# Altium project labRat_ArtixSeven.PrjPcb
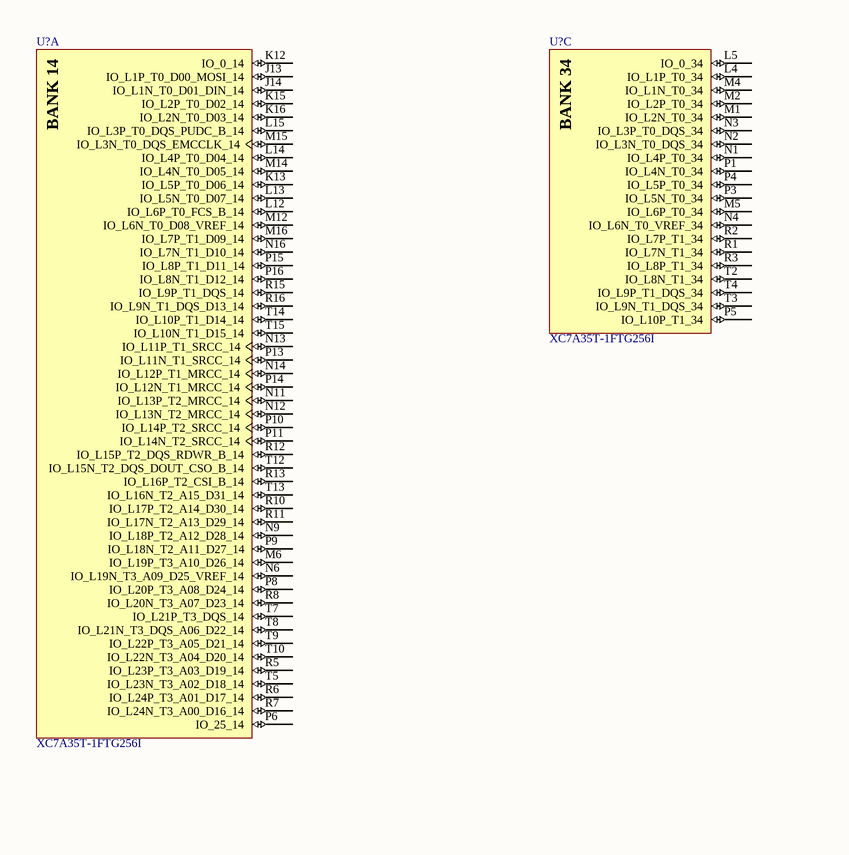
[diagram p0: Main.SchDoc, left]
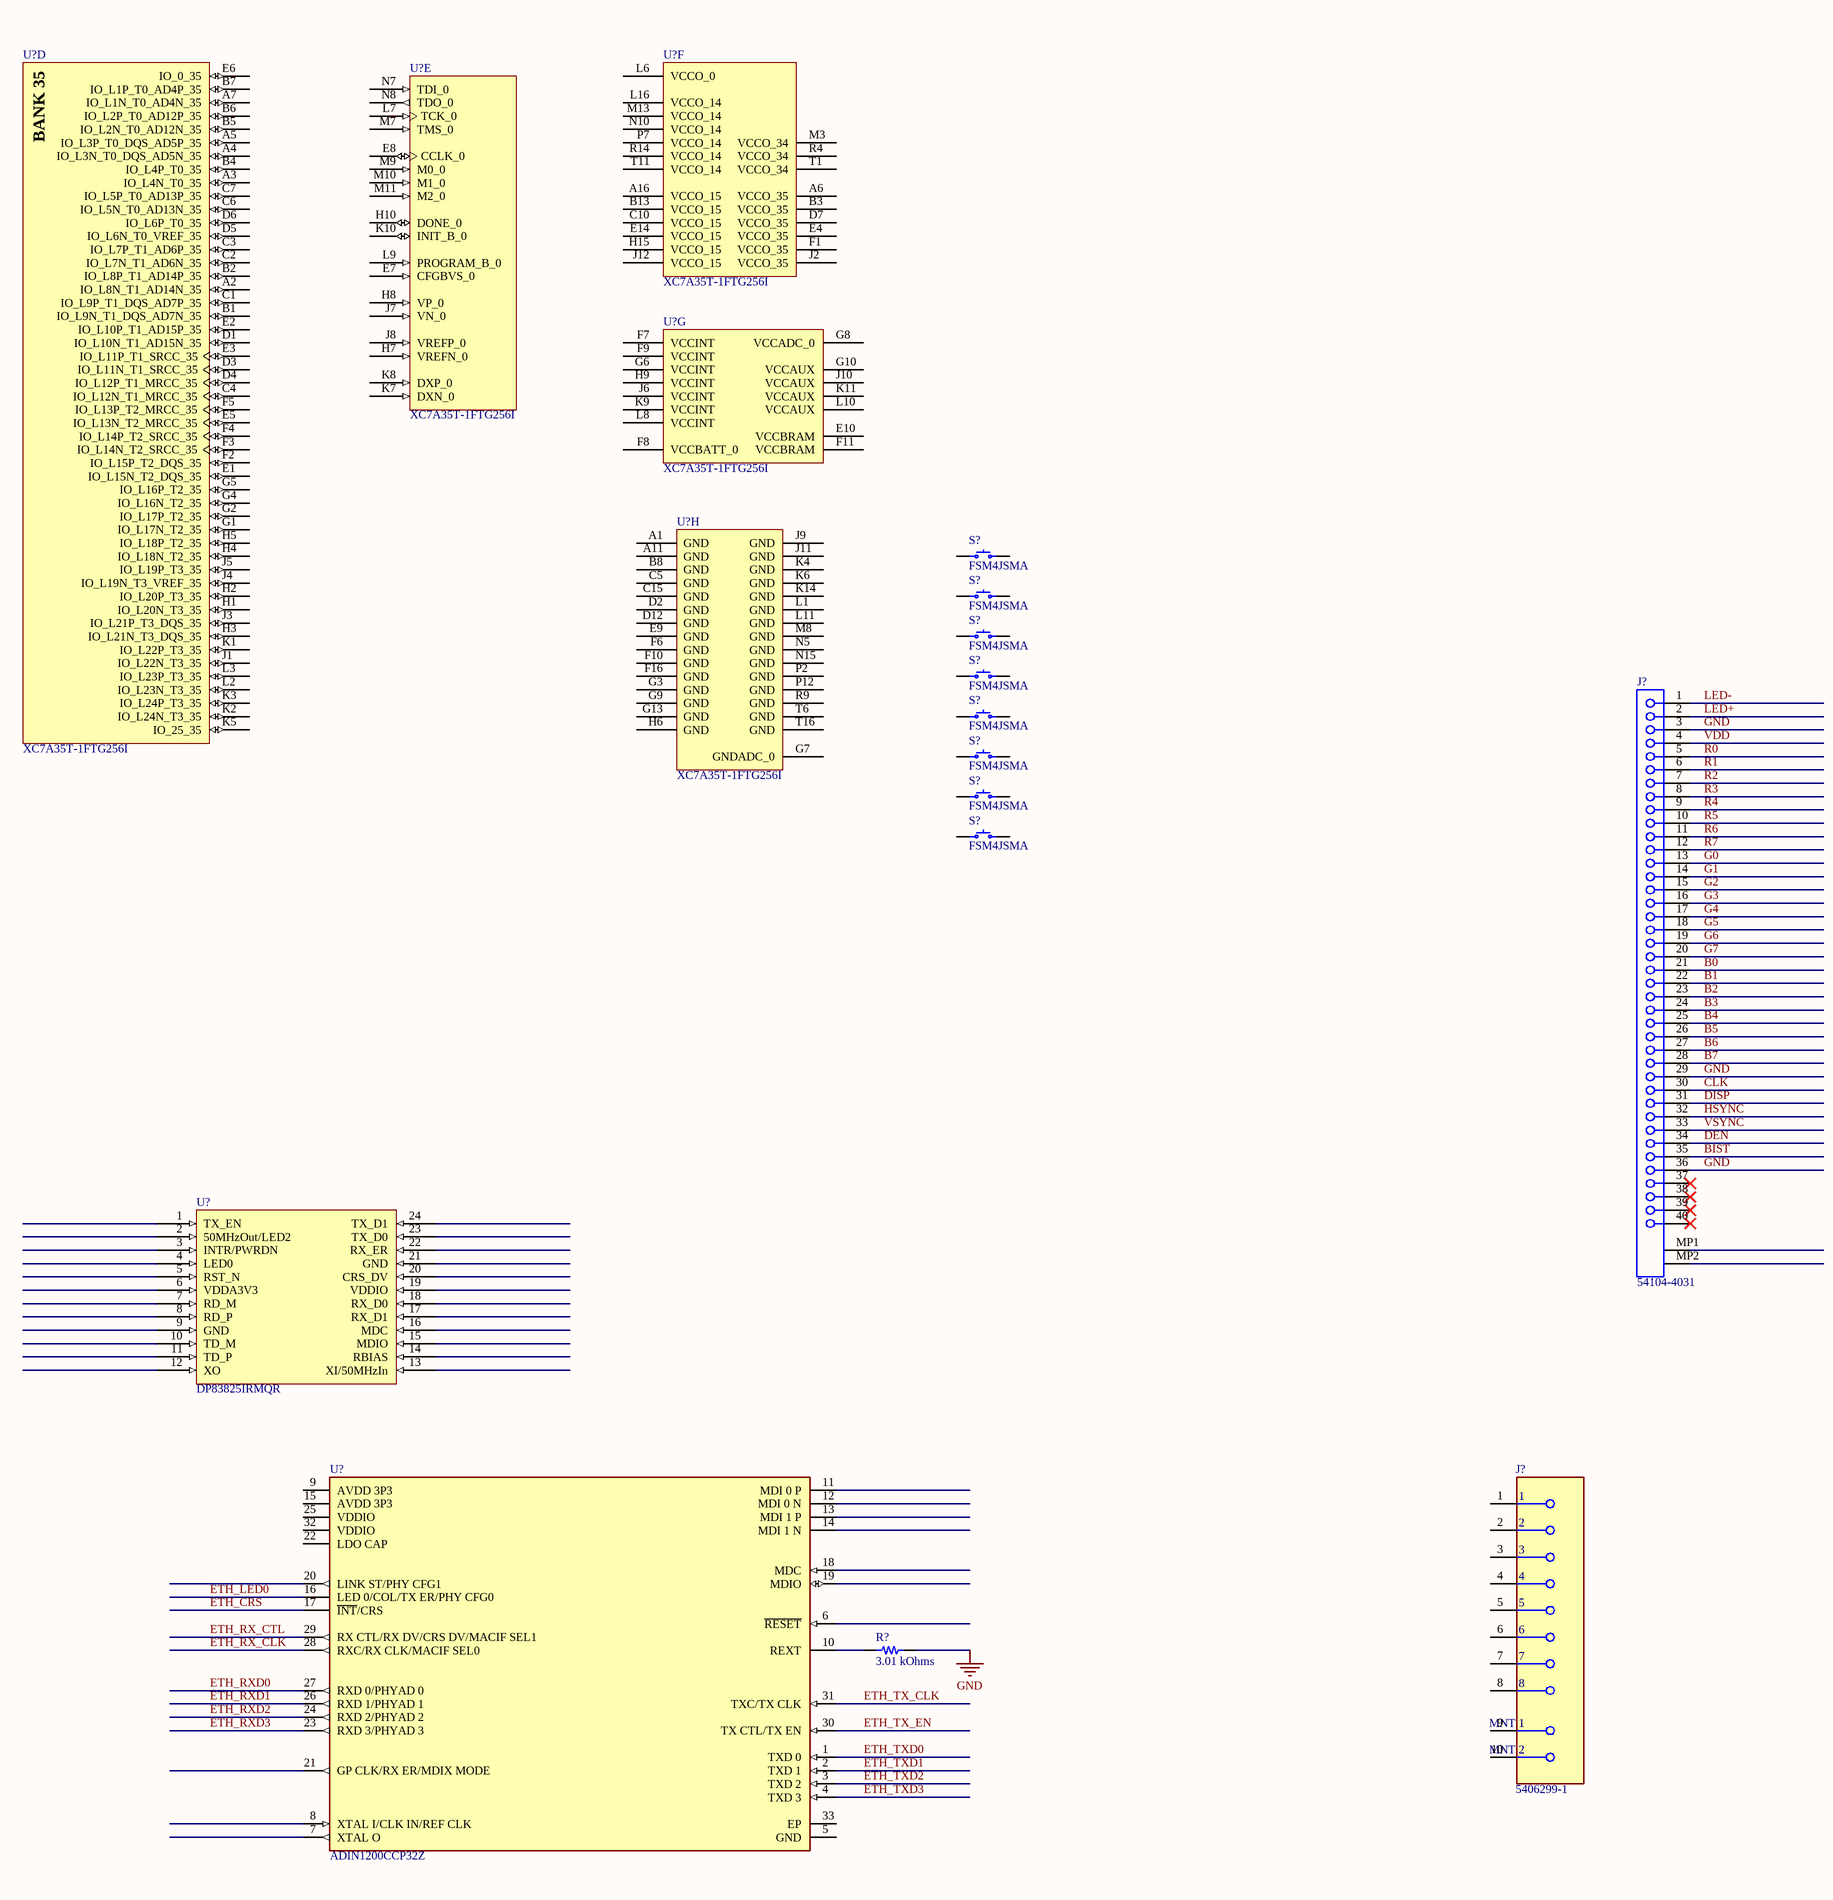
[diagram p1: Main.SchDoc, right]
3 sheets, 63 parts. Net scope: global (net labels, ports and power ports of the same name join across sheets).
Sheets:
  Main.SchDoc
  USB.SchDoc
  DDR3.SchDoc

## Sheet Main.SchDoc
size A2; SheetNumber: 1; SheetTotal: 3

### Parts
(Parts that share a designator on the sheet are numbered #1, #2 ... from top to bottom, then left to right.)
J?#1  54104-4031  [MOLX-54104-4031]
J?#2  5406299-1  [FP-5406299-1-MFG]
R?#1  3.01 kOhms  [RES 0603_1608]
S?#1  FSM4JSMA  [TE FSM4JSMA]
S?#2  FSM4JSMA  [TE FSM4JSMA]
S?#3  FSM4JSMA  [TE FSM4JSMA]
S?#4  FSM4JSMA  [TE FSM4JSMA]
S?#5  FSM4JSMA  [TE FSM4JSMA]
S?#6  FSM4JSMA  [TE FSM4JSMA]
S?#7  FSM4JSMA  [TE FSM4JSMA]
S?#8  FSM4JSMA  [TE FSM4JSMA]
U?#1  XC7A35T-1FTG256I  [FTG256]  (part A of 8)
U?#2  XC7A35T-1FTG256I  [FTG256]  (part C of 8)
U?#3  XC7A35T-1FTG256I  [FTG256]  (part D of 8)
U?#4  XC7A35T-1FTG256I  [FTG256]  (part F of 8)
U?#5  XC7A35T-1FTG256I  [FTG256]  (part E of 8)
U?#6  XC7A35T-1FTG256I  [FTG256]  (part G of 8)
U?#7  XC7A35T-1FTG256I  [FTG256]  (part H of 8)
U?#8  DP83825IRMQR
U?#9  ADIN1200CCP32Z  [FP-CP-32-31-MFG]

### Nets
GND: J?#1.3 J?#1.29 J?#1.36 R?#1.2
B0: J?#1.21
B1: J?#1.22
B2: J?#1.23
B3: J?#1.24
B4: J?#1.25
B5: J?#1.26
B6: J?#1.27
B7: J?#1.28
BIST: J?#1.35
CLK: J?#1.30
DEN: J?#1.34
DISP: J?#1.31
ETH_CRS: U?#9.17(~{INT}/CRS)
ETH_LED0: U?#9.16(LED_0/COL/TX_ER/PHY_CFG0)
ETH_RX_CLK: U?#9.28(RXC/RX_CLK/MACIF_SEL0)
ETH_RX_CTL: U?#9.29(RX_CTL/RX_DV/CRS_DV/MACIF_SEL1)
ETH_RXD0: U?#9.27(RXD_0/PHYAD_0)
ETH_RXD1: U?#9.26(RXD_1/PHYAD_1)
ETH_RXD2: U?#9.24(RXD_2/PHYAD_2)
ETH_RXD3: U?#9.23(RXD_3/PHYAD_3)
ETH_TX_CLK: U?#9.31(TXC/TX_CLK)
ETH_TX_EN: U?#9.30(TX_CTL/TX_EN)
ETH_TXD0: U?#9.1(TXD_0)
ETH_TXD1: U?#9.2(TXD_1)
ETH_TXD2: U?#9.3(TXD_2)
ETH_TXD3: U?#9.4(TXD_3)
G0: J?#1.13
G1: J?#1.14
G2: J?#1.15
G3: J?#1.16
G4: J?#1.17
G5: J?#1.18
G6: J?#1.19
G7: J?#1.20
HSYNC: J?#1.32
LED+: J?#1.2
LED-: J?#1.1
R0: J?#1.5
R1: J?#1.6
R2: J?#1.7
R3: J?#1.8
R4: J?#1.9
R5: J?#1.10
R6: J?#1.11
R7: J?#1.12
VDD: J?#1.4
VSYNC: J?#1.33
NetR?#1_1: R?#1.1 U?#9.10(REXT)
NetS?#1_1: S?#1.1 S?#1.2
NetS?#1_3: S?#1.3 S?#1.4
NetS?#2_1: S?#2.1 S?#2.2
NetS?#2_3: S?#2.3 S?#2.4
NetS?#3_1: S?#3.1 S?#3.2
NetS?#3_3: S?#3.3 S?#3.4
NetS?#4_1: S?#4.1 S?#4.2
NetS?#4_3: S?#4.3 S?#4.4
NetS?#5_1: S?#5.1 S?#5.2
NetS?#5_3: S?#5.3 S?#5.4
NetS?#6_1: S?#6.1 S?#6.2
NetS?#6_3: S?#6.3 S?#6.4
NetS?#7_1: S?#7.1 S?#7.2
NetS?#7_3: S?#7.3 S?#7.4
NetS?#8_1: S?#8.1 S?#8.2
NetS?#8_3: S?#8.3 S?#8.4

Not connected (* = marked no-connect by the designer): J?#1 37* 38* 39* 40* MP1 MP2; J?#2 1 2 3 4 5 6 7 8 9(MNT_1) 10(MNT_2); U?#1 J13(IO_L1P_T0_D00_MOSI_14) J14(IO_L1N_T0_D01_DIN_14) K12(IO_0_14) K13(IO_L5P_T0_D06_14) K15(IO_L2P_T0_D02_14) K16(IO_L2N_T0_D03_14) L12(IO_L6P_T0_FCS_B_14) L13(IO_L5N_T0_D07_14) L14(IO_L4P_T0_D04_14) L15(IO_L3P_T0_DQS_PUDC_B_14) M6(IO_L19P_T3_A10_D26_14) M12(IO_L6N_T0_D08_VREF_14) M14(IO_L4N_T0_D05_14) M15(IO_L3N_T0_DQS_EMCCLK_14) M16(IO_L7P_T1_D09_14) N6(IO_L19N_T3_A09_D25_VREF_14) N9(IO_L18P_T2_A12_D28_14) N11(IO_L13P_T2_MRCC_14) N12(IO_L13N_T2_MRCC_14) N13(IO_L11P_T1_SRCC_14) N14(IO_L12P_T1_MRCC_14) N16(IO_L7N_T1_D10_14) P6(IO_25_14) P8(IO_L20P_T3_A08_D24_14) P9(IO_L18N_T2_A11_D27_14) P10(IO_L14P_T2_SRCC_14) P11(IO_L14N_T2_SRCC_14) P13(IO_L11N_T1_SRCC_14) P14(IO_L12N_T1_MRCC_14) P15(IO_L8P_T1_D11_14) P16(IO_L8N_T1_D12_14) R5(IO_L23P_T3_A03_D19_14) R6(IO_L24P_T3_A01_D17_14) R7(IO_L24N_T3_A00_D16_14) R8(IO_L20N_T3_A07_D23_14) R10(IO_L17P_T2_A14_D30_14) R11(IO_L17N_T2_A13_D29_14) R12(IO_L15P_T2_DQS_RDWR_B_14) R13(IO_L16P_T2_CSI_B_14) R15(IO_L9P_T1_DQS_14) R16(IO_L9N_T1_DQS_D13_14) T5(IO_L23N_T3_A02_D18_14) T7(IO_L21P_T3_DQS_14) T8(IO_L21N_T3_DQS_A06_D22_14) T9(IO_L22P_T3_A05_D21_14) T10(IO_L22N_T3_A04_D20_14) T12(IO_L15N_T2_DQS_DOUT_CSO_B_14) T13(IO_L16N_T2_A15_D31_14) T14(IO_L10P_T1_D14_14) T15(IO_L10N_T1_D15_14); U?#2 L4(IO_L1P_T0_34) L5(IO_0_34) M1(IO_L2N_T0_34) M2(IO_L2P_T0_34) M4(IO_L1N_T0_34) M5(IO_L6P_T0_34) N1(IO_L4P_T0_34) N2(IO_L3N_T0_DQS_34) N3(IO_L3P_T0_DQS_34) N4(IO_L6N_T0_VREF_34) P1(IO_L4N_T0_34) P3(IO_L5N_T0_34) P4(IO_L5P_T0_34) P5(IO_L10P_T1_34) R1(IO_L7N_T1_34) R2(IO_L7P_T1_34) R3(IO_L8P_T1_34) T2(IO_L8N_T1_34) T3(IO_L9N_T1_DQS_34) T4(IO_L9P_T1_DQS_34); U?#3 A2(IO_L8N_T1_AD14N_35) A3(IO_L4N_T0_35) A4(IO_L3N_T0_DQS_AD5N_35) A5(IO_L3P_T0_DQS_AD5P_35) A7(IO_L1N_T0_AD4N_35) B1(IO_L9N_T1_DQS_AD7N_35) B2(IO_L8P_T1_AD14P_35) B4(IO_L4P_T0_35) B5(IO_L2N_T0_AD12N_35) B6(IO_L2P_T0_AD12P_35) B7(IO_L1P_T0_AD4P_35) C1(IO_L9P_T1_DQS_AD7P_35) C2(IO_L7N_T1_AD6N_35) C3(IO_L7P_T1_AD6P_35) C4(IO_L12N_T1_MRCC_35) C6(IO_L5N_T0_AD13N_35) C7(IO_L5P_T0_AD13P_35) D1(IO_L10N_T1_AD15N_35) D3(IO_L11N_T1_SRCC_35) D4(IO_L12P_T1_MRCC_35) D5(IO_L6N_T0_VREF_35) D6(IO_L6P_T0_35) E1(IO_L15N_T2_DQS_35) E2(IO_L10P_T1_AD15P_35) E3(IO_L11P_T1_SRCC_35) E5(IO_L13N_T2_MRCC_35) E6(IO_0_35) F2(IO_L15P_T2_DQS_35) F3(IO_L14N_T2_SRCC_35) F4(IO_L14P_T2_SRCC_35) F5(IO_L13P_T2_MRCC_35) G1(IO_L17N_T2_35) G2(IO_L17P_T2_35) G4(IO_L16N_T2_35) G5(IO_L16P_T2_35) H1(IO_L20N_T3_35) H2(IO_L20P_T3_35) H3(IO_L21N_T3_DQS_35) H4(IO_L18N_T2_35) H5(IO_L18P_T2_35) J1(IO_L22N_T3_35) J3(IO_L21P_T3_DQS_35) J4(IO_L19N_T3_VREF_35) J5(IO_L19P_T3_35) K1(IO_L22P_T3_35) K2(IO_L24N_T3_35) K3(IO_L24P_T3_35) K5(IO_25_35) L2(IO_L23N_T3_35) L3(IO_L23P_T3_35); U?#4 A6(VCCO_35) A16(VCCO_15) B3(VCCO_35) B13(VCCO_15) C10(VCCO_15) D7(VCCO_35) E4(VCCO_35) E14(VCCO_15) F1(VCCO_35) H15(VCCO_15) J2(VCCO_35) J12(VCCO_15) L6(VCCO_0) L16(VCCO_14) M3(VCCO_34) M13(VCCO_14) N10(VCCO_14) P7(VCCO_14) R4(VCCO_34) R14(VCCO_14) T1(VCCO_34) T11(VCCO_14); U?#5 E7(CFGBVS_0) E8(CCLK_0) H7(VREFN_0) H8(VP_0) H10(DONE_0) J7(VN_0) J8(VREFP_0) K7(DXN_0) K8(DXP_0) K10(INIT_B_0) L7(TCK_0) L9(PROGRAM_B_0) M7(TMS_0) M9(M0_0) M10(M1_0) M11(M2_0) N7(TDI_0) N8(TDO_0); U?#6 E10(VCCBRAM) F7(VCCINT) F8(VCCBATT_0) F9(VCCINT) F11(VCCBRAM) G6(VCCINT) G8(VCCADC_0) G10(VCCAUX) H9(VCCINT) J6(VCCINT) J10(VCCAUX) K9(VCCINT) K11(VCCAUX) L8(VCCINT) L10(VCCAUX); U?#7 A1(GND) A11(GND) B8(GND) C5(GND) C15(GND) D2(GND) D12(GND) E9(GND) F6(GND) F10(GND) F16(GND) G3(GND) G7(GNDADC_0) G9(GND) G13(GND) H6(GND) J9(GND) J11(GND) K4(GND) K6(GND) K14(GND) L1(GND) L11(GND) M8(GND) N5(GND) N15(GND) P2(GND) P12(GND) R9(GND) T6(GND) T16(GND); U?#8 1(TX_EN) 2(50MHzOut/LED2) 3(INTR/PWRDN) 4(LED0) 5(RST_N) 6(VDDA3V3) 7(RD_M) 8(RD_P) 9(GND) 10(TD_M) 11(TD_P) 12(XO) 13(XI/50MHzIn) 14(RBIAS) 15(MDIO) 16(MDC) 17(RX_D1) 18(RX_D0) 19(VDDIO) 20(CRS_DV) 21(GND) 22(RX_ER) 23(TX_D0) 24(TX_D1); U?#9 5(GND) 6(~{RESET}) 7(XTAL_O) 8(XTAL_I/CLK_IN/REF_CLK) 9(AVDD_3P3) 11(MDI_0_P) 12(MDI_0_N) 13(MDI_1_P) 14(MDI_1_N) 15(AVDD_3P3) 18(MDC) 19(MDIO) 20(LINK_ST/PHY_CFG1) 21(GP_CLK/RX_ER/MDIX_MODE) 22(LDO_CAP) 25(VDDIO) 32(VDDIO) 33(EP)

### Notes on the sheet
- (in symbol CMP-0383-00026-1, part A) BANK 14
- (in symbol CMP-0383-00026-1, part C) BANK 34
- (in symbol CMP-0383-00026-1, part D) BANK 35

### Library data of the parts
J?#1 = CMP-1241-00508-1: 0.5 mm Pitch Easy-On(TM) Type FPC Connector, 2.0 mm Mated Height, Right Angle, ZIF, SMT, Top Contact, 40 Circuits, -20 to 85 degC, ELV and RoHS Compliant, Tape and Reel; Manufacturer: Molex; PCB Retention: Yes; Current (Max per Contact): 0.5A; Stackable: No; Durability (mating cycles max): 20; Pitch - Mating Interface: 0.50mm; Circuits (Loaded): 40; Mated Height: 2.00mm; Entry Angle: 90degrees Angle; Material - Metal: Phosphor Bronze; Voltage (Max): 50V; ComponentLink3URL: http://www.molex.com/pdm_docs/sd/541044031_sd.pdf; ComponentLink2URL: http://www.molex.com/webdocs/datasheets/pdf/en-us/0541044031_FFC_FPC_CONNECTORS.pdf; Number of Rows: 1; ComponentLink1Description: Manufacturer URL; ComponentLink2Description: Datasheet; Mounting Technology: Surface Mount; ComponentLink1URL: http://www.molex.com/molex/index.jsp; RoHS: TRUE; PackageReference: 54104-4031; Polarized to PCB: Yes; ComponentLink3Description: Package Specification; PackageVersion: Rev. F, 06/2012; PackageDescription: 40-Lead FPC Connector, Pitch 0.5 mm; Contact Position: Top; PCB Locator: No; PartNumber: 54104-4031; Orientation: Right Angle; Packing: Tape and Reel
J?#2 = CMP-03371-000007-1: CONN MOD JACK 8P8C R/A SHIELDED; Manufacturer: TE Connectivity; Current Rating: 1.5A; Number Of Contacts: 8; Description: Jack Modular Connector 8p8c (RJ45, Ethernet) 90° Angle (Right) Shielded, EMI Finger Cat5; Pitch: 1.27mm; Is Female: yes; Shielding: true; Voltage Rating: 150V; Conn Orientation: Right Angle; Conn Gender: Female; Contact Material: Gold,Nickel; Temperature Range Low: -40°C; Height: 14.73mm; Category: Conn; ComponentLink2URL: https://www.te.com/usa-en/product-5406299-1.html?te_bu=Cor&te_type=other&te_campaign=oct_glo_cor-oct-global-oth-prtnr-fy19-oct-octo-buy-bom_sma-298_2&elqCampaignId=35216; Package: 5406299-1; Lead Free: Yes; Octopart: https://octopart.com/5406299-1-te+connectivity-40212272; Digikey Description: CONN MOD JACK 8P8C R/A SHIELDED; ComponentLink2Description: Datasheet; Automotive: No; Device Class L1: Connectors; Temperature Range High: +85°C; Mouser Description: Conn RJ-45 F 8 POS 2.54mm Solder RA Thru-Hole 8 Terminal 1 Port Cat 5 Box/Tray; RoHS: TRUE; Manufacturer Part Number: 5406299-1; Temperature: -40°C to +85°C; Device Class L2: Modular / Ethernet Connectors; Device Class L3: unset
R?#1 = ERJ-PB3D3011V: RES SMD 3.01K OHM 0.5% 1/5W 0603; Manufacturer: Panasonic Electronic Components; Power (Watts): 0.2W, 1/5W; Temperature Coefficient: ±50ppm/°C; Part Number: ERJ-PB3D3011V; Value: 3.01 kOhms; ComponentLink1Description: Datasheet; ComponentLink1URL: https://industrial.panasonic.com/cdbs/www-data/pdf/RDM0000/AOA0000C328.pdf; ComponentLink2Description: DigiKey Link; ComponentLink2URL: http://digikey.com/product-detail/en/panasonic-electronic-components/ERJ-PB3D3011V/P20336CT-ND/6214591; Composition: Thick Film; Device Package: 0603 (1608 Metric); Features: Automotive AEC-Q200, Pulse Withstanding; Height - Seated (Max): 0.022" (0.55mm); LastUpdated: 9/2/2020 1:09:38 AM; Lifecycle Status: Active; Minimum Order: 1; Number of Terminations: 2; Operating Temperature: -55°C ~ 155°C; Package / Case: 0603 (1608 Metric); Packaging: TapeAndReel; PartId: 24334; Part Status: Active; Price: 0.02; Ratings: AEC-Q200; Resistance: 3.01 kOhms; Series: ERJ; Size / Dimension: 0.063" L x 0.031" W (1.60mm x 0.80mm); Supplier 1: DigiKey; Supplier Part Number 1: P20336CT-ND; Supplier Device Package: 0603; Tolerance: ±0.5%
S?#1-S?#8 = FSM4JSMA: SWITCH TACTILE SPST-NO 0.05A 24V; Manufacturer: TE Connectivity ALCOSWITCH Switches; Actuator Height off PCB, Vertical: 5.00mm; Actuator Orientation: Top Actuated; Actuator Type: Standard; Contact Rating @ Voltage: 0.05A @ 24VDC; Illumination: Non-Illuminated; Operating Force: 160gf; Outline: 6.00mm x 6.00mm; Switch Function: Off-Mom; Part Number: FSM4JSMA; Circuit: SPST-NO; ComponentLink1Description: Datasheet; ComponentLink1URL: https://www.te.com/commerce/DocumentDelivery/DDEController?Action=srchrtrv&DocNm=1308111-1_SWITCHES_CORE_PROGRAM_CATALOG&DocType=CS&DocLang=English; ComponentLink2Description: DigiKey Link; ComponentLink2URL: http://digikey.com/product-detail/en/te-connectivity-alcoswitch-switches/FSM4JSMA/450-1129-ND/525821; LastUpdated: 9/2/2020 1:27:07 AM; Lifecycle Status: Active; Minimum Order: 1; Mounting Type: Surface Mount; Operating Temperature: -35°C ~ 85°C; Packaging: Bulk; Part Status: Active; Price: 0.23; Series: FSMJSMA; Supplier 1: DigiKey; Supplier Part Number 1: 450-1129-ND; Termination Style: Gull Wing
U?#1-U?#7 = CMP-0383-00026-1: Artix-7 FPGA, 170 User I/Os, 0 GTP, 256-Ball BGA, Speed Grade 1, Industrial Grade, Pb-Free; Manufacturer: Xilinx; Speed Grades: 1; Logic Cells: 33280; Available User I/O: 170; CMTs: 5; GTP: 0; Total Block RAM: 1800 Kb; ComponentLink3Description: Pinout; ComponentLink2Description: Datasheet; ComponentLink1Description: Manufacturer URL; DatasheetVersion: Rev. 1.15; ComponentLink4URL: http://www.xilinx.com/support/documentation/user_guides/ug475_7Series_Pkg_Pinout.pdf; ComponentLink4Description: Package Specification; ComponentLink1URL: http://www.xilinx.com/; PackageReference: FTG-256; Maximum Distributed RAM: 400 Kb; PartNumber: XC7A35T-1FTG256I; ComponentLink2URL: http://www.xilinx.com/support/documentation/data_sheets/ds180_7Series_Overview.pdf; Mounting Technology: Surface Mount; Operating Temperature Range: Industrial; PackageVersion: Rev. 1.11; ComponentLink3URL: http://www.xilinx.com/support/documentation/user_guides/ug475_7Series_Pkg_Pinout.pdf; PackageDescription: 256-Ball Wire-Bond Fine-Pitch Thin BGA, Body 17 x 17 mm, Pitch 1 mm
U?#8 = DP83825IRMQR: Manufacturer: Texas Instruments; Supplier 1: Digi-Key; Manufacturer Part Number: DP83825IRMQR; RoHS: Yes; Category: Interface ICs; Stock 1: 2260; Pricing 1: 1=1.40000, 10=1.25100, 25=1.18720, 100=0.91160, 250=0.80560, 500=0.76320, 1000=0.59360 (USD); Supplier Part Number 1: 296-DP83825IRMQRCT-ND
U?#9 = CMP-09095-000001-1: INDUSTRIAL ETHERNET GIGABIT PHY; Manufacturer: Analog Devices; Nominal Supply Current: 20-31mA; Data Rate: 100Mbits/s; Standoff Height: 0.02mm; Description: 4/4 Transceiver Full, Half Ethernet, IEEE 802.3, MII, RMII, PHY2 32-LFCSP (5x5); Max Junction Temp: +125°C; Min Supply Voltage: 1.71V; Simplex Duplex: Full Duplex; Max Supply Voltage: 3.46V; Number Of Channels: 4; ComponentLink2URL: https://www.analog.com/media/en/technical-documentation/data-sheets/ADIN1200.pdf; Height: 0.8mm; Automotive: No; RoHS: TRUE; Digikey Description: INDUSTRIAL ETHERNET GIGABIT PHY; Package: CP-32-31; Octopart: https://octopart.com/adin1200ccp32z-analog+devices-103760365; Device Class L3: Ethernet Interface ICs; Interface: Ethernet; Temperature: -40°C to +105°C; Category: IC; Lead Free: Yes; Device Class L2: Interface ICs; Ipc Land Pattern Name: QFN50P500X500X75-32; Ambient Temperature Range High: +105°C; Manufacturer Part Number: ADIN1200CCP32Z; Device Class L1: Integrated Circuits (ICs); ComponentLink2Description: Datasheet; Footprint Url: https://forum.upverter.com/uploads/short-url/dN8iC8CK9Ps5z8gUJcfltSaVrDQ.pdf; Temperature Range High: +105°C; Ambient Temperature Range Low: -40°C; Temperature Range Low: -40°C

## Sheet USB.SchDoc
size A; SheetNumber: 2; SheetTotal: 2
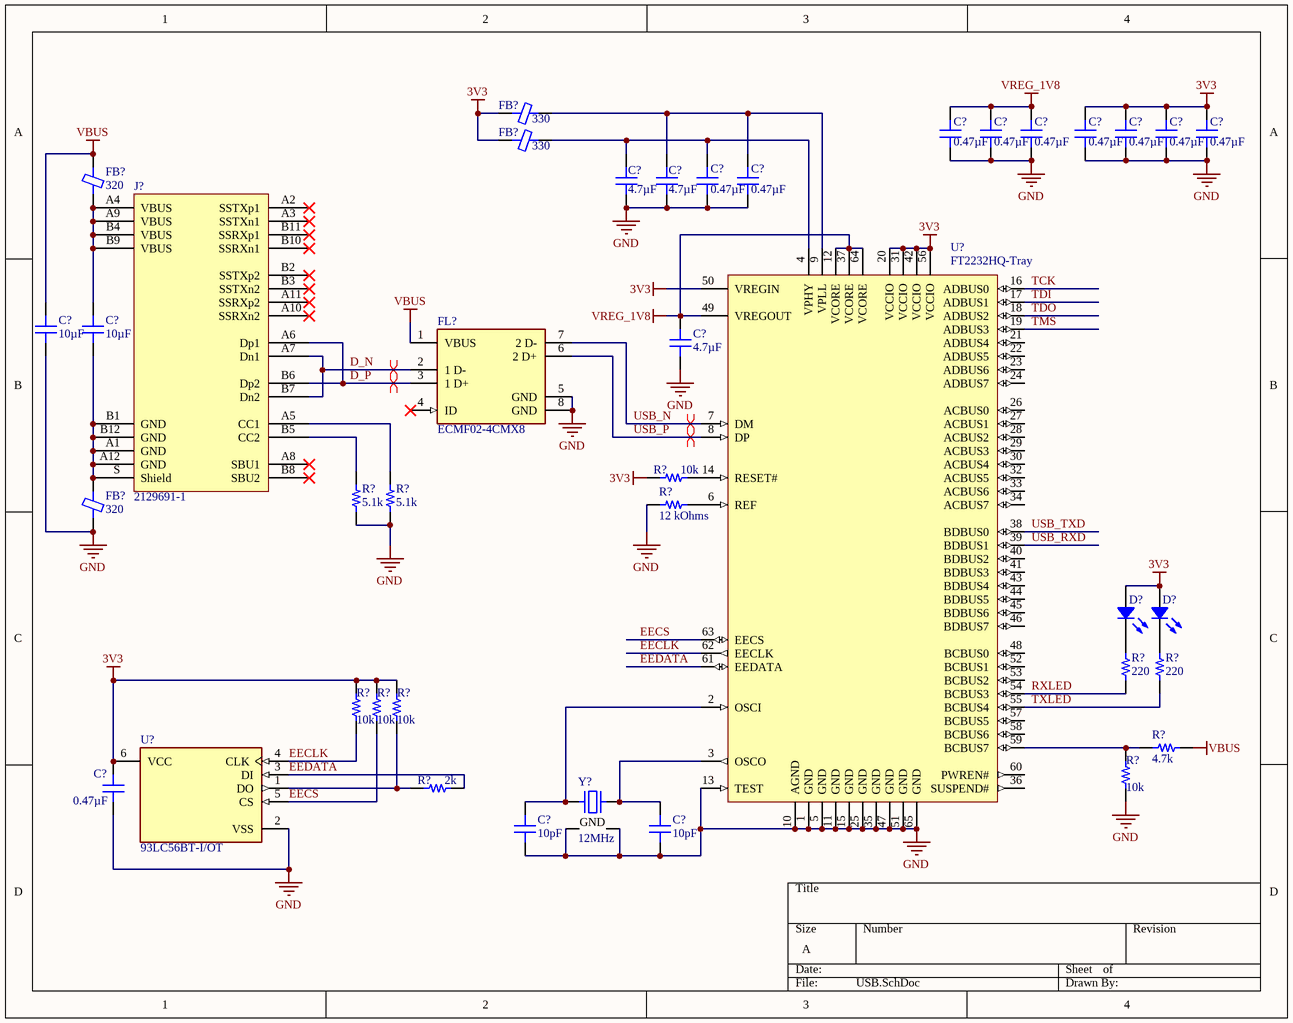
[diagram p2: USB.SchDoc]

### Parts
(Parts that share a designator on the sheet are numbered #1, #2 ... from top to bottom, then left to right.)
C?#1  0.47µF  [CAP 0603_1608]
C?#2  0.47µF  [CAP 0603_1608]
C?#3  0.47µF  [CAP 0603_1608]
C?#4  0.47µF  [CAP 0603_1608]
C?#5  0.47µF  [CAP 0603_1608]
C?#6  0.47µF  [CAP 0603_1608]
C?#7  0.47µF  [CAP 0603_1608]
C?#8  4.7µF  [CAP 0603_1608]
C?#9  4.7µF  [CAP 0603_1608]
C?#10  0.47µF  [CAP 0603_1608]
C?#11  0.47µF  [CAP 0603_1608]
C?#12  10µF  [CAP 0805_2012]
C?#13  10µF  [CAP 0805_2012]
C?#14  4.7µF  [CAP 0603_1608]
C?#15  0.47µF  [CAP 0603_1608]
C?#16  10pF  [CAP 0603_1608]
C?#17  10pF  [CAP 0603_1608]
D?#1  Yellow  [LED 0805_2012 YELLOW]  (value not drawn)
D?#2  Yellow  [LED 0805_2012 YELLOW]  (value not drawn)
FB?#1  330  [FER 0603_1608]
FB?#2  330  [FER 0603_1608]
FB?#3  320  [FER 0805_2012]
FB?#4  320  [FER 0805_2012]
FL?  ECMF02-4CMX8  [FP-Micro_QFN-8L-MFG]
J?#3  2129691-1  [TE USB-C 2129691-1]
R?#2  10k  [RES 0603_1608]
R?#3  5.1k  [RES 0603_1608]
R?#4  5.1k  [RES 0603_1608]
R?#5  12 kOhms  [RES 0603_1608]
R?#6  220  [RES 0603_1608]
R?#7  220  [RES 0603_1608]
R?#8  10k  [RES 0603_1608]
R?#9  10k  [RES 0603_1608]
R?#10  10k  [RES 0603_1608]
R?#11  4.7k  [RES 0603_1608]
R?#12  10k  [RES 0603_1608]
R?#13  2k  [RES 0603_1608]
U?#10  FT2232HQ-Tray  [QFN64_2_N]
U?#11  93LC56BT-I/OT  [FP-C04-028-MFG]
Y?  12MHz  [NDK NX3225SA]

### Nets
3V3: C?#4.2 C?#5.2 C?#6.2 C?#7.2 C?#15.1 D?#1.1 D?#2.1 FB?#1.1 FB?#2.1 R?#2.1 R?#8.2 R?#9.2 R?#10.2 U?#10.20(VCCIO) U?#10.31(VCCIO) U?#10.42(VCCIO) U?#10.50(VREGIN) U?#10.56(VCCIO) U?#11.6(VCC)
GND: C?#1.1 C?#2.1 C?#3.1 C?#4.1 C?#5.1 C?#6.1 C?#7.1 C?#8.1 C?#9.1 C?#10.1 C?#11.1 C?#12.1 C?#14.1 C?#15.2 C?#16.2 C?#17.2 FB?#4.1 FL?.5(GND) FL?.8(GND) R?#3.2 R?#4.2 R?#5.1 R?#12.1 U?#10.1(GND) U?#10.5(GND) U?#10.10(AGND) U?#10.11(GND) U?#10.13(TEST) U?#10.15(GND) U?#10.25(GND) U?#10.35(GND) U?#10.47(GND) U?#10.51(GND) U?#10.65(GND) U?#11.2(VSS) Y?.2(GND) Y?.4(GND)
VBUS: C?#12.2 FB?#3.2 FL?.1(VBUS) R?#11.2
VREG_1V8: C?#1.2 C?#2.2 C?#3.2 C?#14.2 U?#10.12(VCORE) U?#10.37(VCORE) U?#10.49(VREGOUT) U?#10.64(VCORE)
D_N: FL?.2(1_D-) J?#3.A7(Dn1) J?#3.B7(Dn2)
D_P: FL?.3(1_D+) J?#3.A6(Dp1) J?#3.B6(Dp2)
EECLK: R?#8.1 U?#10.62(EECLK) U?#11.4(CLK)
EECS: R?#9.1 U?#10.63(EECS) U?#11.5(CS)
EEDATA: R?#13.2 U?#10.61(EEDATA) U?#11.3(DI)
RXLED: R?#6.1 U?#10.54(BCBUS3)
TCK: U?#10.16(ADBUS0)
TDI: U?#10.17(ADBUS1)
TDO: U?#10.18(ADBUS2)
TMS: U?#10.19(ADBUS3)
TXLED: R?#7.1 U?#10.55(BCBUS4)
USB_N: FL?.7(2_D-) U?#10.7(DM)
USB_P: FL?.6(2_D+) U?#10.8(DP)
USB_RXD: U?#10.39(BDBUS1)
USB_TXD: U?#10.38(BDBUS0)
NetC?#8_2: C?#8.2 C?#10.2 FB?#2.2 U?#10.4(VPHY)
NetC?#9_2: C?#9.2 C?#11.2 FB?#1.2 U?#10.9(VPLL)
NetC?#13_1: C?#13.1 FB?#4.2 J?#3.A1(GND) J?#3.A12(GND) J?#3.B1(GND) J?#3.B12(GND) J?#3.S(Shield)
NetC?#13_2: C?#13.2 FB?#3.1 J?#3.A4(VBUS) J?#3.A9(VBUS) J?#3.B4(VBUS) J?#3.B9(VBUS)
NetC?#16_1: C?#16.1 U?#10.2(OSCI) Y?.1
NetC?#17_1: C?#17.1 U?#10.3(OSCO) Y?.3
NetD?#1_2: D?#1.2 R?#6.2
NetD?#2_2: D?#2.2 R?#7.2
NetJ?#3_A5: J?#3.A5(CC1) R?#4.1
NetJ?#3_B5: J?#3.B5(CC2) R?#3.1
NetR?#2_2: R?#2.2 U?#10.14(RESET#)
NetR?#5_2: R?#5.2 U?#10.6(REF)
NetR?#10_1: R?#10.1 R?#13.1 U?#11.1(DO)
NetR?#11_1: R?#11.1 R?#12.2 U?#10.59(BCBUS7)

Not connected (* = marked no-connect by the designer): FL? 4(ID)*; J?#3 A2(SSTXp1)* A3(SSTXn1)* A8(SBU1)* A10(SSRXn2)* A11(SSRXp2)* B2(SSTXp2)* B3(SSTXn2)* B8(SBU2)* B10(SSRXn1)* B11(SSRXp1)*; U?#10 21(ADBUS4) 22(ADBUS5) 23(ADBUS6) 24(ADBUS7) 26(ACBUS0) 27(ACBUS1) 28(ACBUS2) 29(ACBUS3) 30(ACBUS4) 32(ACBUS5) 33(ACBUS6) 34(ACBUS7) 36(SUSPEND#) 40(BDBUS2) 41(BDBUS3) 43(BDBUS4) 44(BDBUS5) 45(BDBUS6) 46(BDBUS7) 48(BCBUS0) 52(BCBUS1) 53(BCBUS2) 57(BCBUS5) 58(BCBUS6) 60(PWREN#)

### Layout directives
differential pair: D_N, D_P, USB_N, USB_P

### Library data of the parts
C?#1-C?#7 C?#10 C?#11 C?#15 = GCM188R71C474KA55D: CAP CER 0.47UF 16V X7R 0603; Manufacturer: Murata Electronics; Tolerance: ±10%; Part Number: GCM188R71C474KA55D; Value: 0.47µF; Applications: Automotive; Capacitance: 0.47µF; ComponentLink1Description: Datasheet; ComponentLink1URL: https://www.murata.com/~/media/webrenewal/support/library/catalog/products/capacitor/mlcc/c03e.ashx?la=en-us; ComponentLink2Description: DigiKey Link; ComponentLink2URL: http://digikey.com/product-detail/en/murata-electronics/GCM188R71C474KA55D/490-4775-1-ND/1641694; Device Package: 0603 (1608 Metric); LastUpdated: 9/2/2020 1:03:20 AM; Lifecycle Status: Active; Minimum Order: 1; Mounting Type: Surface Mount, MLCC; Operating Temperature: -55°C ~ 125°C; Package / Case: 0603 (1608 Metric); Packaging: TapeAndReel; PartId: 11207; Part Status: Active; Price: 0.04; Ratings: AEC-Q200; Series: GCM; Size / Dimension: 0.063" L x 0.031" W (1.60mm x 0.80mm); Supplier 1: DigiKey; Supplier Part Number 1: 490-4775-1-ND; Temperature Coefficient: X7R; Thickness (Max): 0.035" (0.90mm); Voltage - Rated: 16V
C?#8 C?#9 C?#14 = C1608X7S0J475K080AC: CAP CER 4.7UF 6.3V X7S 0603; Manufacturer: TDK Corporation; Tolerance: ±10%; Part Number: C1608X7S0J475K080AC; Value: 4.7µF; Applications: General Purpose; Capacitance: 4.7µF; ComponentLink1Description: Datasheet; ComponentLink1URL: https://product.tdk.com/info/en/catalog/datasheets/mlcc_commercial_general_en.pdf?ref_disty=digikey; ComponentLink2Description: DigiKey Link; ComponentLink2URL: http://digikey.com/product-detail/en/tdk-corporation/C1608X7S0J475K080AC/445-9120-1-ND/3661604; Device Package: 0603 (1608 Metric); Features: Low ESL; LastUpdated: 9/2/2020 1:03:32 AM; Lifecycle Status: Active; Minimum Order: 1; Mounting Type: Surface Mount, MLCC; Operating Temperature: -55°C ~ 125°C; Package / Case: 0603 (1608 Metric); Packaging: TapeAndReel; PartId: 4119; Part Status: Active; Price: 0.07; Series: C; Size / Dimension: 0.063" L x 0.031" W (1.60mm x 0.80mm); Supplier 1: DigiKey; Supplier Part Number 1: 445-9120-1-ND; Temperature Coefficient: X7S; Thickness (Max): 0.035" (0.90mm); Voltage - Rated: 6.3V
C?#12 C?#13 = C2012X5R1E106K125AB: CAP CER 10UF 25V X5R 0805; Manufacturer: TDK Corporation; Tolerance: ±10%; Part Number: C2012X5R1E106K125AB; Value: 10µF; Applications: General Purpose; Capacitance: 10µF; ComponentLink1Description: Datasheet; ComponentLink1URL: https://product.tdk.com/info/en/catalog/datasheets/mlcc_commercial_general_en.pdf?ref_disty=digikey; ComponentLink2Description: DigiKey Link; ComponentLink2URL: http://digikey.com/product-detail/en/tdk-corporation/C2012X5R1E106K125AB/445-5984-1-ND/2444025; Device Package: 0805 (2012 Metric); Features: Low ESL; LastUpdated: 9/2/2020 1:04:38 AM; Lifecycle Status: Active; Minimum Order: 1; Mounting Type: Surface Mount, MLCC; Operating Temperature: -55°C ~ 85°C; Package / Case: 0805 (2012 Metric); Packaging: TapeAndReel; PartId: 4850; Part Status: Active; Price: 0.08; Series: C; Size / Dimension: 0.079" L x 0.049" W (2.00mm x 1.25mm); Supplier 1: DigiKey; Supplier Part Number 1: 445-5984-1-ND; Temperature Coefficient: X5R; Thickness (Max): 0.057" (1.45mm); Voltage - Rated: 25V
C?#16 C?#17 = 06031A100CAT2A: CAP CER 10PF 100V C0G/NP0 0603; Manufacturer: AVX Corporation; Temperature Coefficient: C0G, NP0; Tolerance: ±0.25pF; Part Number: 06031A100CAT2A; Value: 10pF; Applications: General Purpose; Capacitance: 10pF; ComponentLink1Description: Datasheet; ComponentLink1URL: http://datasheets.avx.com/C0GNP0-Dielectric.pdf; ComponentLink2Description: DigiKey Link; ComponentLink2URL: http://digikey.com/product-detail/en/avx-corporation/06031A100CAT2A/478-3668-1-ND/1116366; Device Package: 0603 (1608 Metric); LastUpdated: 9/2/2020 1:03:34 AM; Lifecycle Status: Active; Minimum Order: 1; Mounting Type: Surface Mount, MLCC; Operating Temperature: -55°C ~ 125°C; Package / Case: 0603 (1608 Metric); Packaging: TapeAndReel; PartId: 3258; Part Status: Active; Price: 0.06; Series: -; Size / Dimension: 0.063" L x 0.032" W (1.60mm x 0.81mm); Supplier 1: DigiKey; Supplier Part Number 1: 478-3668-1-ND; Thickness (Max): 0.035" (0.90mm); Voltage - Rated: 100V
D?#1 D?#2 = 5988140107F: LED YELLOW CLEAR 0805 SMD; Manufacturer: Dialight; Configuration: Standard; Current - Test: 20mA; Lens Color: Colorless; Lens Size: 1.40mm x 1.25mm; Lens Style: Rectangle with Flat Top; Millicandela Rating: 130mcd; Viewing Angle: 140°; Voltage - Forward (Vf) (Typ): 2V; Wavelength - Dominant: 593nm; Part Number: 5988140107F; Color: Yellow; ComponentLink1Description: Datasheet; ComponentLink1URL: //media.digikey.com/pdf/Data%20Sheets/Dialight%20PDFs/598_Series_0805_Pkg.pdf; ComponentLink2Description: DigiKey Link; ComponentLink2URL: http://digikey.com/product-detail/en/dialight/5988140107F/350-2041-1-ND/1291345; Device Package: 0805 (2012 Metric); Height (Max): 0.80mm; LastUpdated: 9/2/2020 1:21:22 AM; Lens Transparency: Clear; Lifecycle Status: Active; Minimum Order: 1; Mounting Type: Surface Mount; Package / Case: 0805 (2012 Metric); Packaging: TapeAndReel; PartId: 48; Part Status: Active; Price: 0.07; Series: 598; Size / Dimension: 2.00mm L x 1.25mm W; Supplier 1: DigiKey; Supplier Part Number 1: 350-2041-1-ND; Supplier Device Package: 0805; Value: Yellow
FB?#1 FB?#2 = FBMH1608HM331-TV: FERRITE BEAD 330 OHM 0603 1LN; Manufacturer: Taiyo Yuden; Current Rating (Max): 1.2A; DC Resistance (DCR) (Max): 130mOhm; Filter Type: Power Line; Impedance @ Frequency: 330 Ohms @ 100MHz; Number of Lines: 1; Part Number: FBMH1608HM331-TV; ComponentLink1Description: Datasheet; ComponentLink1URL: https://ds.yuden.co.jp/TYCOMPAS/ut/detail?pn=FBMH1608HM331-TV  &u=M; ComponentLink2Description: DigiKey Link; ComponentLink2URL: http://digikey.com/product-detail/en/taiyo-yuden/FBMH1608HM331-TV/587-3823-1-ND/4875583; Device Package: 0603 (1608 Metric); Height (Max): 0.035" (0.90mm); LastUpdated: 9/2/2020 1:18:18 AM; Lifecycle Status: Active; Minimum Order: 1; Mounting Type: Surface Mount; Operating Temperature: -40°C ~ 125°C; Package / Case: 0603 (1608 Metric); Packaging: TapeAndReel; PartId: 729; Part Status: Active; Price: 0.05; Ratings: AEC-Q200; Series: FB; Size / Dimension: 0.063" L x 0.032" W (1.60mm x 0.80mm); Supplier 1: DigiKey; Supplier Part Number 1: 587-3823-1-ND; Value: 330
FB?#3 FB?#4 = 74279220321: FERRITE BEAD 320 OHM 0805 1LN; Manufacturer: Würth Elektronik; Current Rating (Max): 2.5A; DC Resistance (DCR) (Max): 50mOhm; Impedance @ Frequency: 320 Ohms @ 100MHz; Number of Lines: 1; Part Number: 74279220321; ComponentLink1Description: Datasheet; ComponentLink1URL: https://katalog.we-online.de/pbs/datasheet/74279220321.pdf; ComponentLink2Description: DigiKey Link; ComponentLink2URL: http://digikey.com/product-detail/en/w-rth-elektronik/74279220321/732-6125-1-ND/5050861; Device Package: 0805 (2012 Metric); Height (Max): 0.043" (1.10mm); LastUpdated: 9/2/2020 1:18:21 AM; Lifecycle Status: Active; Minimum Order: 1; Mounting Type: Surface Mount; Operating Temperature: -55°C ~ 125°C; Package / Case: 0805 (2012 Metric); Packaging: TapeAndReel; PartId: 1527; Part Status: Active; Price: 0.20; Series: WE-MPSB; Size / Dimension: 0.079" L x 0.047" W (2.00mm x 1.20mm); Supplier 1: DigiKey; Supplier Part Number 1: 732-6125-1-ND; Value: 320
FL? = CMP-12075-000002-1: COMMON MODE CHOKE 2LN SMD ESD; Number of Lines: 2; DC Resistance (DCR): 4R; Package Quantity: 3000; Case/Package: QFN; Width: 0.047inch; Mount: Surface Mount; Termination: Flat; Length: 0.098inch; Height: 0.022inch; Lead Free: Lead Free; Depth: 1.25mm; REACH SVHC: No SVHC; Max Operating Temperature: 85°C; Min Operating Temperature: -30°C; Number of Pins: 8; Packaging: Tape and Reel
J?#3 = 2129691-1: CONN RCPT USB3.1 TYPEC 24POS SMD; Manufacturer: TE Connectivity AMP Connectors; Connector Type: USB - C (Type - C); Current Rating (Amps): 0.25A, 1.25A, 5A; Gender: Receptacle; Mating Cycles: 10000; Number of Contacts: 24; Number of Ports: 1; Specifications: USB 3.1 (USB 3.1 Gen 2, Superspeed+); Voltage - Rated: 30V; Part Number: 2129691-1; ComponentLink1Description: Datasheet; ComponentLink1URL: //media.digikey.com/pdf/Data%20Sheets/Tyco%20Electonics%20AMP%20PDFs/2129691_Dwg.pdf; ComponentLink2Description: DigiKey Link; ComponentLink2URL: //digikey.com/product-detail/en/te-connectivity-amp-connectors/2129691-1/A122008TR-ND/5401336; LastUpdated: 12/9/2019 8:50:18 PM; Lifecycle Status: 0; Minimum Order: 1; Mounting Feature: Horizontal, Mid Mount; Mounting Type: Board Edge, Cutout; Surface Mount; Through Hole, Right Angle; Operating Temperature: -30°C ~ 85°C; Packaging: TapeAndReel; Part Status: Active; Price: 1.67; Series: -; Supplier 1: DigiKey; Supplier Part Number 1: A122008TR-ND; Termination: Solder
R?#2 R?#8-R?#10 R?#12 = CRCW060310K0FKTA: RES SMD 10K OHM 1% 1/10W 0603; Manufacturer: Vishay Dale; Power (Watts): 0.1W, 1/10W; Resistance: 10 kOhms; Temperature Coefficient: ±100ppm/°C; Part Number: CRCW060310K0FKTA; Value: 10k; ComponentLink1Description: Datasheet; ComponentLink1URL: http://www.vishay.com/docs/20008/dcrcw.pdf; ComponentLink2Description: DigiKey Link; ComponentLink2URL: http://digikey.com/product-detail/en/vishay-dale/CRCW060310K0FKTA/541-2980-1-ND/6073623; Composition: Thick Film; Device Package: 0603 (1608 Metric); Features: Automotive AEC-Q200; Height - Seated (Max): 0.020" (0.50mm); LastUpdated: 9/2/2020 1:10:15 AM; Lifecycle Status: Active; Minimum Order: 1; Number of Terminations: 2; Operating Temperature: -55°C ~ 155°C; Package / Case: 0603 (1608 Metric); Packaging: TapeAndReel; PartId: 9687; Part Status: Active; Price: 0.01; Ratings: AEC-Q200; Series: CRCW; Size / Dimension: 0.063" L x 0.033" W (1.60mm x 0.85mm); Supplier 1: DigiKey; Supplier Part Number 1: 541-2980-1-ND; Supplier Device Package: 0603; Tolerance: ±1%
R?#3 R?#4 = RMCF0603FT5K10: RES 5.1K OHM 1% 1/10W 0603; Manufacturer: Stackpole Electronics Inc; Power (Watts): 0.1W, 1/10W; Resistance: 5.1 kOhms; Temperature Coefficient: ±100ppm/°C; Part Number: RMCF0603FT5K10; Value: 5.1k; ComponentLink1Description: Datasheet; ComponentLink1URL: https://www.seielect.com/catalog/sei-rmcf_rmcp.pdf; ComponentLink2Description: DigiKey Link; ComponentLink2URL: http://digikey.com/product-detail/en/stackpole-electronics-inc/RMCF0603FT5K10/RMCF0603FT5K10CT-ND/1943037; Composition: Thick Film; Device Package: 0603 (1608 Metric); Features: Automotive AEC-Q200; Height - Seated (Max): 0.022" (0.55mm); LastUpdated: 9/2/2020 1:10:13 AM; Lifecycle Status: Active; Minimum Order: 1; Number of Terminations: 2; Operating Temperature: -55°C ~ 155°C; Package / Case: 0603 (1608 Metric); Packaging: CutTape; PartId: 10617; Part Status: Active; Price: 0.10; Ratings: AEC-Q200; Series: RMCF; Size / Dimension: 0.061" L x 0.031" W (1.55mm x 0.80mm); Supplier 1: DigiKey; Supplier Part Number 1: RMCF0603FT5K10CT-ND; Supplier Device Package: 0603; Tolerance: ±1%
R?#5 = CRCW060312K0FKEAHP: RES SMD 12K OHM 1% 1/4W 0603; Manufacturer: Vishay Dale; Power (Watts): 0.25W, 1/4W; Temperature Coefficient: ±100ppm/°C; Part Number: CRCW060312K0FKEAHP; Value: 12 kOhms; ComponentLink1Description: Datasheet; ComponentLink1URL: http://www.vishay.com/docs/20043/crcwhpe3.pdf; ComponentLink2Description: DigiKey Link; ComponentLink2URL: http://digikey.com/product-detail/en/vishay-dale/CRCW060312K0FKEAHP/541-12.0KSCT-ND/5326820; Composition: Thick Film; Device Package: 0603 (1608 Metric); Features: Automotive AEC-Q200, Pulse Withstanding; Height - Seated (Max): 0.022" (0.55mm); LastUpdated: 9/2/2020 1:10:12 AM; Lifecycle Status: Active; Minimum Order: 1; Number of Terminations: 2; Operating Temperature: -55°C ~ 155°C; Package / Case: 0603 (1608 Metric); Packaging: TapeAndReel; PartId: 11340; Part Status: Active; Price: 0.02; Ratings: AEC-Q200; Resistance: 12 kOhms; Series: CRCW-HP; Size / Dimension: 0.063" L x 0.033" W (1.60mm x 0.85mm); Supplier 1: DigiKey; Supplier Part Number 1: 541-12.0KSCT-ND; Supplier Device Package: 0603; Tolerance: ±1%
R?#6 R?#7 = RT0603FRE07220RL: RES SMD 220 OHM 1% 1/10W 0603; Manufacturer: Yageo; Power (Watts): 0.1W, 1/10W; Resistance: 220 Ohms; Temperature Coefficient: ±50ppm/°C; Part Number: RT0603FRE07220RL; Value: 220; ComponentLink1Description: Datasheet; ComponentLink1URL: https://www.yageo.com/upload/media/product/productsearch/datasheet/rchip/PYu-RT_1-to-0.01_RoHS_L_11.pdf; ComponentLink2Description: DigiKey Link; ComponentLink2URL: http://digikey.com/product-detail/en/yageo/RT0603FRE07220RL/YAG5947CT-ND/9370977; Composition: Thin Film; Device Package: 0603 (1608 Metric); Height - Seated (Max): 0.022" (0.55mm); LastUpdated: 9/2/2020 1:10:07 AM; Lifecycle Status: Active; Minimum Order: 1; Number of Terminations: 2; Operating Temperature: -55°C ~ 155°C; Package / Case: 0603 (1608 Metric); Packaging: TapeAndReel; PartId: 13479; Part Status: Active; Price: 0.01; Series: RT; Size / Dimension: 0.063" L x 0.031" W (1.60mm x 0.80mm); Supplier 1: DigiKey; Supplier Part Number 1: YAG5947CT-ND; Supplier Device Package: 0603; Tolerance: ±1%
R?#11 = CRCW06034K70FKTA: RES SMD 4.7K OHM 1% 1/10W 0603; Manufacturer: Vishay Dale; Power (Watts): 0.1W, 1/10W; Resistance: 4.7 kOhms; Temperature Coefficient: ±100ppm/°C; Part Number: CRCW06034K70FKTA; Value: 4.7k; ComponentLink1Description: Datasheet; ComponentLink1URL: http://www.vishay.com/docs/20008/dcrcw.pdf; ComponentLink2Description: DigiKey Link; ComponentLink2URL: http://digikey.com/product-detail/en/vishay-dale/CRCW06034K70FKTA/541-3004-1-ND/6073647; Composition: Thick Film; Device Package: 0603 (1608 Metric); Features: Automotive AEC-Q200; Height - Seated (Max): 0.020" (0.50mm); LastUpdated: 9/2/2020 1:09:40 AM; Lifecycle Status: Active; Minimum Order: 1; Number of Terminations: 2; Operating Temperature: -55°C ~ 155°C; Package / Case: 0603 (1608 Metric); Packaging: TapeAndReel; PartId: 23863; Part Status: Active; Price: 0.01; Ratings: AEC-Q200; Series: CRCW; Size / Dimension: 0.063" L x 0.033" W (1.60mm x 0.85mm); Supplier 1: DigiKey; Supplier Part Number 1: 541-3004-1-ND; Supplier Device Package: 0603; Tolerance: ±1%
R?#13 = RT0603FRE072KL: RES SMD 2K OHM 1% 1/10W 0603; Manufacturer: Yageo; Power (Watts): 0.1W, 1/10W; Resistance: 2 kOhms; Temperature Coefficient: ±50ppm/°C; Part Number: RT0603FRE072KL; Value: 2k; ComponentLink1Description: Datasheet; ComponentLink1URL: https://www.yageo.com/upload/media/product/productsearch/datasheet/rchip/PYu-RT_1-to-0.01_RoHS_L_11.pdf; ComponentLink2Description: DigiKey Link; ComponentLink2URL: http://digikey.com/product-detail/en/yageo/RT0603FRE072KL/YAG5956CT-ND/9370986; Composition: Thin Film; Device Package: 0603 (1608 Metric); Height - Seated (Max): 0.022" (0.55mm); LastUpdated: 9/2/2020 1:09:47 AM; Lifecycle Status: Active; Minimum Order: 1; Number of Terminations: 2; Operating Temperature: -55°C ~ 155°C; Package / Case: 0603 (1608 Metric); Packaging: TapeAndReel; PartId: 22292; Part Status: Active; Price: 0.01; Series: RT; Size / Dimension: 0.063" L x 0.031" W (1.60mm x 0.80mm); Supplier 1: DigiKey; Supplier Part Number 1: YAG5956CT-ND; Supplier Device Package: 0603; Tolerance: ±1%
U?#10 = CMP-0078-00003-3: Dual High Speed USB To Multipurpose UART/FIFO IC, 64-pin QFN, Tray; Manufacturer: FTDI; PackageVersion: Jun-12; ComponentLink2URL: http://www.ftdichip.com/Support/Documents/DataSheets/ICs/DS_FT2232H.pdf; ComponentLink1Description: Manufacturer URL; RevisionNote: DatasheetVersion updated to 2.21 Jun-2012; PackageReference: QFN64_2; PackageDescription: 64-Pin Quad Flat No-Lead, 9 x 9 mm Body, 0.5 mm Pitch, 4.35 x 4.35 mm Exposed Pad; ComponentLink2Description: Datasheet; ComponentLink1URL: http://www.ftdichip.com/; PartNumber: FT2232HQ-Tray; DatasheetVersion: ver 2.21, Jun-2012
U?#11 = CMP-0162-00356-2: IC EEPROM 2K SPI 2MHZ SOT23-6; Access Time: 250ns; Density: 2Kb; Max Supply Voltage: 5.5V; Interface: Serial; Min Supply Voltage: 2.5V; Nominal Supply Current: 2mA; Number of Pins: 6; Radiation Hardening: No; Length: 3.1mm; Height: 1.3mm; Min Operating Temperature: -40°C; Max Operating Temperature: 85°C; Lead Free: Lead Free; Memory Type: EEPROM; Contact Plating: Tin; REACH SVHC: No SVHC; Package Quantity: 3000; Frequency: 2MHz; Width: 1.8mm; Max Frequency: 2MHz; Case/Package: SOT-23; Mount: Surface Mount; Packaging: Tape and Reel; Memory Size: 2Kb
Y? = NX3225SA-12MHZ-STD-CSR-3: CRYSTAL 12.0000MHZ 8PF SMD; Manufacturer: NDK America, Inc.; ESR (Equivalent Series Resistance): 100 Ohms; Frequency Stability: ±15ppm; Operating Mode: Fundamental; Part Number: NX3225SA-12MHZ-STD-CSR-3; ComponentLink1Description: Datasheet; ComponentLink1URL: //media.digikey.com/pdf/Data%20Sheets/NDK%20PDFs/NX3225SA_STD-CSR-3.pdf; ComponentLink2Description: DigiKey Link; ComponentLink2URL: http://digikey.com/product-detail/en/ndk-america-inc/NX3225SA-12MHZ-STD-CSR-3/644-1179-1-ND/3125568; Frequency: 12MHz; Frequency Tolerance: ±15ppm; Height - Seated (Max): 0.024" (0.60mm); LastUpdated: 9/2/2020 1:21:59 AM; Lifecycle Status: Active; Load Capacitance: 8pF; Minimum Order: 1; Mounting Type: Surface Mount; Operating Temperature: -10°C ~ 75°C; Package / Case: 4-SMD, No Lead; Packaging: TapeAndReel; PartId: 578; Part Status: Active; Price: 0.45; Series: NX3225SA; Size / Dimension: 0.126" L x 0.098" W (3.20mm x 2.50mm); Supplier 1: DigiKey; Supplier Part Number 1: 644-1179-1-ND; Type: MHz Crystal; Value: 12MHz

## Sheet DDR3.SchDoc
size A; SheetNumber: 3; SheetTotal: 3
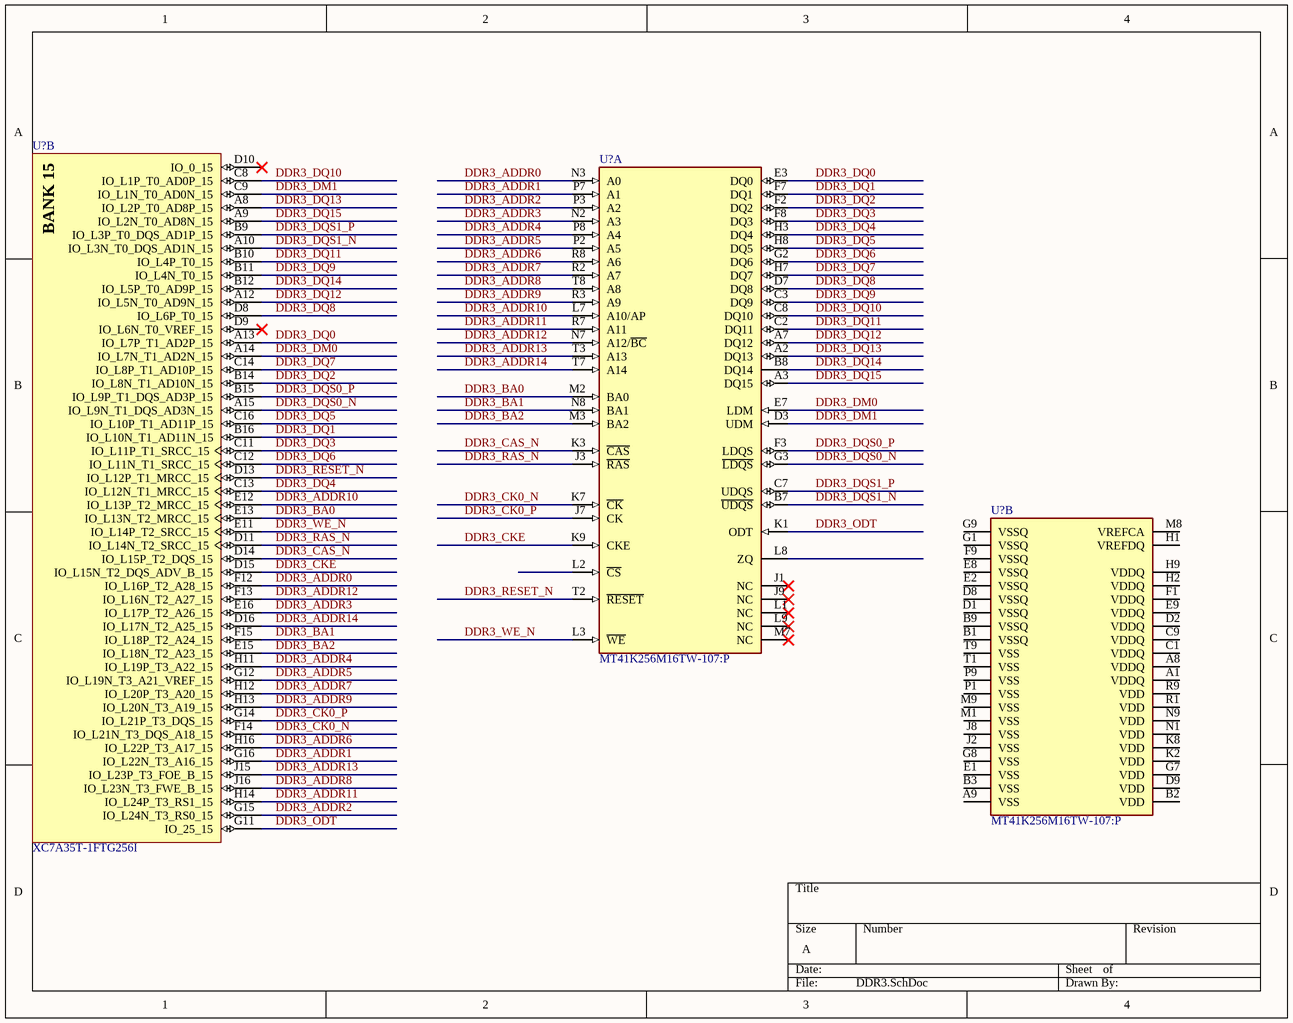
[diagram p3: DDR3.SchDoc]

### Parts
(Parts that share a designator on the sheet are numbered #1, #2 ... from top to bottom, then left to right.)
U?#12  XC7A35T-1FTG256I  [FTG256]  (part B of 8)
U?#13  MT41K256M16TW-107:P  [FP-TW-IPC_C]  (part A of 2)
U?#14  MT41K256M16TW-107:P  [FP-TW-IPC_C]  (part B of 2)

### Nets
DDR3_ADDR0: U?#12.F12(IO_L16P_T2_A28_15) U?#13.N3(A0)
DDR3_ADDR1: U?#12.G16(IO_L22N_T3_A16_15) U?#13.P7(A1)
DDR3_ADDR2: U?#12.G15(IO_L24N_T3_RS0_15) U?#13.P3(A2)
DDR3_ADDR3: U?#12.E16(IO_L17P_T2_A26_15) U?#13.N2(A3)
DDR3_ADDR4: U?#12.H11(IO_L19P_T3_A22_15) U?#13.P8(A4)
DDR3_ADDR5: U?#12.G12(IO_L19N_T3_A21_VREF_15) U?#13.P2(A5)
DDR3_ADDR6: U?#12.H16(IO_L22P_T3_A17_15) U?#13.R8(A6)
DDR3_ADDR7: U?#12.H12(IO_L20P_T3_A20_15) U?#13.R2(A7)
DDR3_ADDR8: U?#12.J16(IO_L23N_T3_FWE_B_15) U?#13.T8(A8)
DDR3_ADDR9: U?#12.H13(IO_L20N_T3_A19_15) U?#13.R3(A9)
DDR3_ADDR10: U?#12.E12(IO_L13P_T2_MRCC_15) U?#13.L7(A10/AP)
DDR3_ADDR11: U?#12.H14(IO_L24P_T3_RS1_15) U?#13.R7(A11)
DDR3_ADDR12: U?#12.F13(IO_L16N_T2_A27_15) U?#13.N7(A12/~{BC})
DDR3_ADDR13: U?#12.J15(IO_L23P_T3_FOE_B_15) U?#13.T3(A13)
DDR3_ADDR14: U?#12.D16(IO_L17N_T2_A25_15) U?#13.T7(A14)
DDR3_BA0: U?#12.E13(IO_L13N_T2_MRCC_15) U?#13.M2(BA0)
DDR3_BA1: U?#12.F15(IO_L18P_T2_A24_15) U?#13.N8(BA1)
DDR3_BA2: U?#12.E15(IO_L18N_T2_A23_15) U?#13.M3(BA2)
DDR3_CAS_N: U?#12.D14(IO_L15P_T2_DQS_15) U?#13.K3(~{CAS})
DDR3_CK0_N: U?#12.F14(IO_L21N_T3_DQS_A18_15) U?#13.K7(~{CK})
DDR3_CK0_P: U?#12.G14(IO_L21P_T3_DQS_15) U?#13.J7(CK)
DDR3_CKE: U?#12.D15(IO_L15N_T2_DQS_ADV_B_15) U?#13.K9(CKE)
DDR3_DM0: U?#12.A14(IO_L7N_T1_AD2N_15) U?#13.E7(LDM)
DDR3_DM1: U?#12.C9(IO_L1N_T0_AD0N_15) U?#13.D3(UDM)
DDR3_DQ0: U?#12.A13(IO_L7P_T1_AD2P_15) U?#13.E3(DQ0)
DDR3_DQ1: U?#12.B16(IO_L10N_T1_AD11N_15) U?#13.F7(DQ1)
DDR3_DQ2: U?#12.B14(IO_L8N_T1_AD10N_15) U?#13.F2(DQ2)
DDR3_DQ3: U?#12.C11(IO_L11P_T1_SRCC_15) U?#13.F8(DQ3)
DDR3_DQ4: U?#12.C13(IO_L12N_T1_MRCC_15) U?#13.H3(DQ4)
DDR3_DQ5: U?#12.C16(IO_L10P_T1_AD11P_15) U?#13.H8(DQ5)
DDR3_DQ6: U?#12.C12(IO_L11N_T1_SRCC_15) U?#13.G2(DQ6)
DDR3_DQ7: U?#12.C14(IO_L8P_T1_AD10P_15) U?#13.H7(DQ7)
DDR3_DQ8: U?#12.D8(IO_L6P_T0_15) U?#13.D7(DQ8)
DDR3_DQ9: U?#12.B11(IO_L4N_T0_15) U?#13.C3(DQ9)
DDR3_DQ10: U?#12.C8(IO_L1P_T0_AD0P_15) U?#13.C8(DQ10)
DDR3_DQ11: U?#12.B10(IO_L4P_T0_15) U?#13.C2(DQ11)
DDR3_DQ12: U?#12.A12(IO_L5N_T0_AD9N_15) U?#13.A7(DQ12)
DDR3_DQ13: U?#12.A8(IO_L2P_T0_AD8P_15) U?#13.A2(DQ13)
DDR3_DQ14: U?#12.B12(IO_L5P_T0_AD9P_15) U?#13.B8(DQ14)
DDR3_DQ15: U?#12.A9(IO_L2N_T0_AD8N_15) U?#13.A3(DQ15)
DDR3_DQS0_N: U?#12.A15(IO_L9N_T1_DQS_AD3N_15) U?#13.G3(~{LDQS})
DDR3_DQS0_P: U?#12.B15(IO_L9P_T1_DQS_AD3P_15) U?#13.F3(LDQS)
DDR3_DQS1_N: U?#12.A10(IO_L3N_T0_DQS_AD1N_15) U?#13.B7(~{UDQS})
DDR3_DQS1_P: U?#12.B9(IO_L3P_T0_DQS_AD1P_15) U?#13.C7(UDQS)
DDR3_ODT: U?#12.G11(IO_25_15) U?#13.K1(ODT)
DDR3_RAS_N: U?#12.D11(IO_L14N_T2_SRCC_15) U?#13.J3(~{RAS})
DDR3_RESET_N: U?#12.D13(IO_L12P_T1_MRCC_15) U?#13.T2(~{RESET})
DDR3_WE_N: U?#12.E11(IO_L14P_T2_SRCC_15) U?#13.L3(~{WE})

Not connected (* = marked no-connect by the designer): U?#12 D9(IO_L6N_T0_VREF_15)* D10(IO_0_15)*; U?#13 J1(NC)* J9(NC)* L1(NC)* L2(~{CS}) L8(ZQ) L9(NC)* M7(NC)*; U?#14 A1(VDDQ) A8(VDDQ) A9(VSS) B1(VSSQ) B2(VDD) B3(VSS) B9(VSSQ) C1(VDDQ) C9(VDDQ) D1(VSSQ) D2(VDDQ) D8(VSSQ) D9(VDD) E1(VSS) E2(VSSQ) E8(VSSQ) E9(VDDQ) F1(VDDQ) F9(VSSQ) G1(VSSQ) G7(VDD) G8(VSS) G9(VSSQ) H1(VREFDQ) H2(VDDQ) H9(VDDQ) J2(VSS) J8(VSS) K2(VDD) K8(VDD) M1(VSS) M8(VREFCA) M9(VSS) N1(VDD) N9(VDD) P1(VSS) P9(VSS) R1(VDD) R9(VDD) T1(VSS) T9(VSS)

### Notes on the sheet
- (in symbol CMP-0383-00026-1, part B) BANK 15

### Library data of the parts
U?#12 = CMP-0383-00026-1: as U?#1 on sheet Main; ComponentLink3Description: Pinout; ComponentLink2Description: Datasheet; ComponentLink1Description: Manufacturer URL; DatasheetVersion: Rev. 1.15; ComponentLink4URL: http://www.xilinx.com/support/documentation/user_guides/ug475_7Series_Pkg_Pinout.pdf; ComponentLink4Description: Package Specification; ComponentLink1URL: http://www.xilinx.com/; PackageReference: FTG-256; Maximum Distributed RAM: 400 Kb; PartNumber: XC7A35T-1FTG256I; ComponentLink2URL: http://www.xilinx.com/support/documentation/data_sheets/ds180_7Series_Overview.pdf; Mounting Technology: Surface Mount; Operating Temperature Range: Industrial; PackageVersion: Rev. 1.11; ComponentLink3URL: http://www.xilinx.com/support/documentation/user_guides/ug475_7Series_Pkg_Pinout.pdf; PackageDescription: 256-Ball Wire-Bond Fine-Pitch Thin BGA, Body 17 x 17 mm, Pitch 1 mm
U?#13 U?#14 = CMP-2000-07475-2: IC DRAM 4G PARALLEL 96FBGA; Manufacturer: Micron; Access Time: 1.07ns; Nominal Supply Current: 12-156mA; Min Supply Voltage: 1.283V; Memory Type: SDRAM,DDR3; Standoff Height: 0.29mm; Max Supply Voltage: 1.45V; Memory Size: 4Gbits; Device Class L1: Integrated Circuits (ICs); Lead Free: Yes; ComponentLink2Description: Datasheet; Manufacturer Part Number: MT41K256M16TW-107:P; Category: IC; Digikey Description: IC DRAM 4G PARALLEL 96FBGA; Device Class L3: RAM; Interface: Parallel; RoHS: TRUE; Octopart: https://octopart.com/mt41k256m16tw-107%3Ap-micron-66533852; Temperature Range High: +85°C; ComponentLink2URL: https://www.micron.com/-/media/client/global/documents/products/data-sheet/dram/ddr3/4gb_ddr3l.pdf; Temperature: 0°C to +85°C; Package: TW; Device Class L2: Memory; Automotive: No; Height: 1.2mm; Temperature Range Low: 0°C

## Nets that join several sheets
GND: Main (J?#1.3 J?#1.29 J?#1.36 R?#1.2), USB (37 pins)